# EAGLE design LED Scematic Version3 (EAGLE 9.2.0)
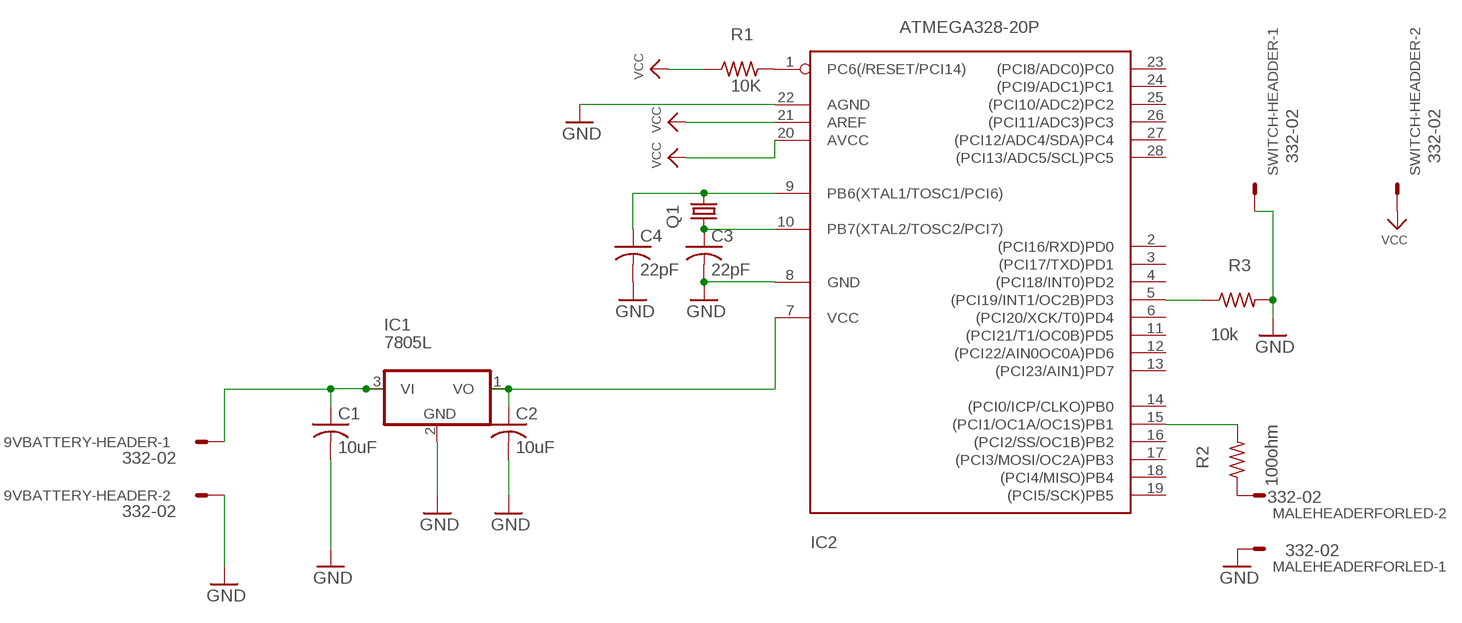
[diagram p0: schematic, sheet 1]

## Parts
9VBATTERY-HEADER  332-02  [332-02]
C1  10uF  C-US025-040X050  [C025-040X050]
C2  10uF  C-US025-040X050  [C025-040X050]
C3  22pF  C-US025-040X050  [C025-040X050]
C4  22pF  C-US025-040X050  [C025-040X050]
IC1  7805L  [TO92]
IC2  ATMEGA328-20P  [DIL28-3]
MALEHEADERFORLED  332-02  [332-02]
Q1  CRYSTALHC49S  [HC49/S]
R1  10K  R-US_0207/12  [0207/12]
R2  100ohm  R-US_0207/12  [0207/12]
R3  10k  R-US_0207/12  [0207/12]
SWITCH-HEADDER  332-02  [332-02]

## Nets
GND: 9VBATTERY-HEADER.2 C1.2 C2.2 C3.2 C4.2 IC1.2(GND) IC2.8(GND) IC2.22(AGND) MALEHEADERFORLED.1 R3.2 SWITCH-HEADDER.1
N$1: IC2.1(PC6(/RESET/PCI14)) R1.2
N$2: C4.1 IC2.9(PB6(XTAL1/TOSC1/PCI6)) Q1.2
N$3: C3.1 IC2.10(PB7(XTAL2/TOSC2/PCI7)) Q1.1
N$4: 9VBATTERY-HEADER.1 C1.1 IC1.3(VI)
N$5: C2.1 IC1.1(VO) IC2.7(VCC)
N$6: IC2.5((PCI19/INT1/OC2B)PD3) R3.1
N$7: IC2.15((PCI1/OC1A/OC1S)PB1) R2.2
N$8: MALEHEADERFORLED.2 R2.1
VCC: IC2.20(AVCC) IC2.21(AREF) R1.1 SWITCH-HEADDER.2
Unconnected: IC2.2((PCI16/RXD)PD0) IC2.3((PCI17/TXD)PD1) IC2.4((PCI18/INT0)PD2) IC2.6((PCI20/XCK/T0)PD4) IC2.11((PCI21/T1/OC0B)PD5) IC2.12((PCI22/AIN0OC0A)PD6) IC2.13((PCI23/AIN1)PD7) IC2.14((PCI0/ICP/CLKO)PB0) IC2.16((PCI2/SS/OC1B)PB2) IC2.17((PCI3/MOSI/OC2A)PB3) IC2.18((PCI4/MISO)PB4) IC2.19((PCI5/SCK)PB5) IC2.23((PCI8/ADC0)PC0) IC2.24((PCI9/ADC1)PC1) IC2.25((PCI10/ADC2)PC2) IC2.26((PCI11/ADC3)PC3) IC2.27((PCI12/ADC4/SDA)PC4) IC2.28((PCI13/ADC5/SCL)PC5)

## Library data of the parts
9VBATTERY-HEADER MALEHEADERFORLED SWITCH-HEADDER = con-garry:332-02: 2 Pin - 2mm Dual Row Source: www.mpe-connector.de / garry_shortform_2012.pdf
C1-C4 = adafruit:C-US: CAPACITOR, American symbol
IC1 = adafruit:78*: Positive VOLTAGE REGULATOR Added bigger pads to the TO-92 package
IC2 = atmega328:ATMEGA328*P: MICROCONTROLLER 32 kBytes FLASH 2 kBytes SRAM 1 kBytes EEPROM USART 8-channel 10 bit ADC
Q1 = adafruit:CRYSTAL: CRYSTAL; OC_FARNELL: 1667008; OC_NEWARK: unknown
R1 R2 = adafruit:R-US_: RESISTOR, American symbol
R3 = adafruit:R-US_: RESISTOR, American symbol; SPICEPREFIX: R

## Net classes
0 default: width 0.508 mm, clearance 0.508 mm

## Board
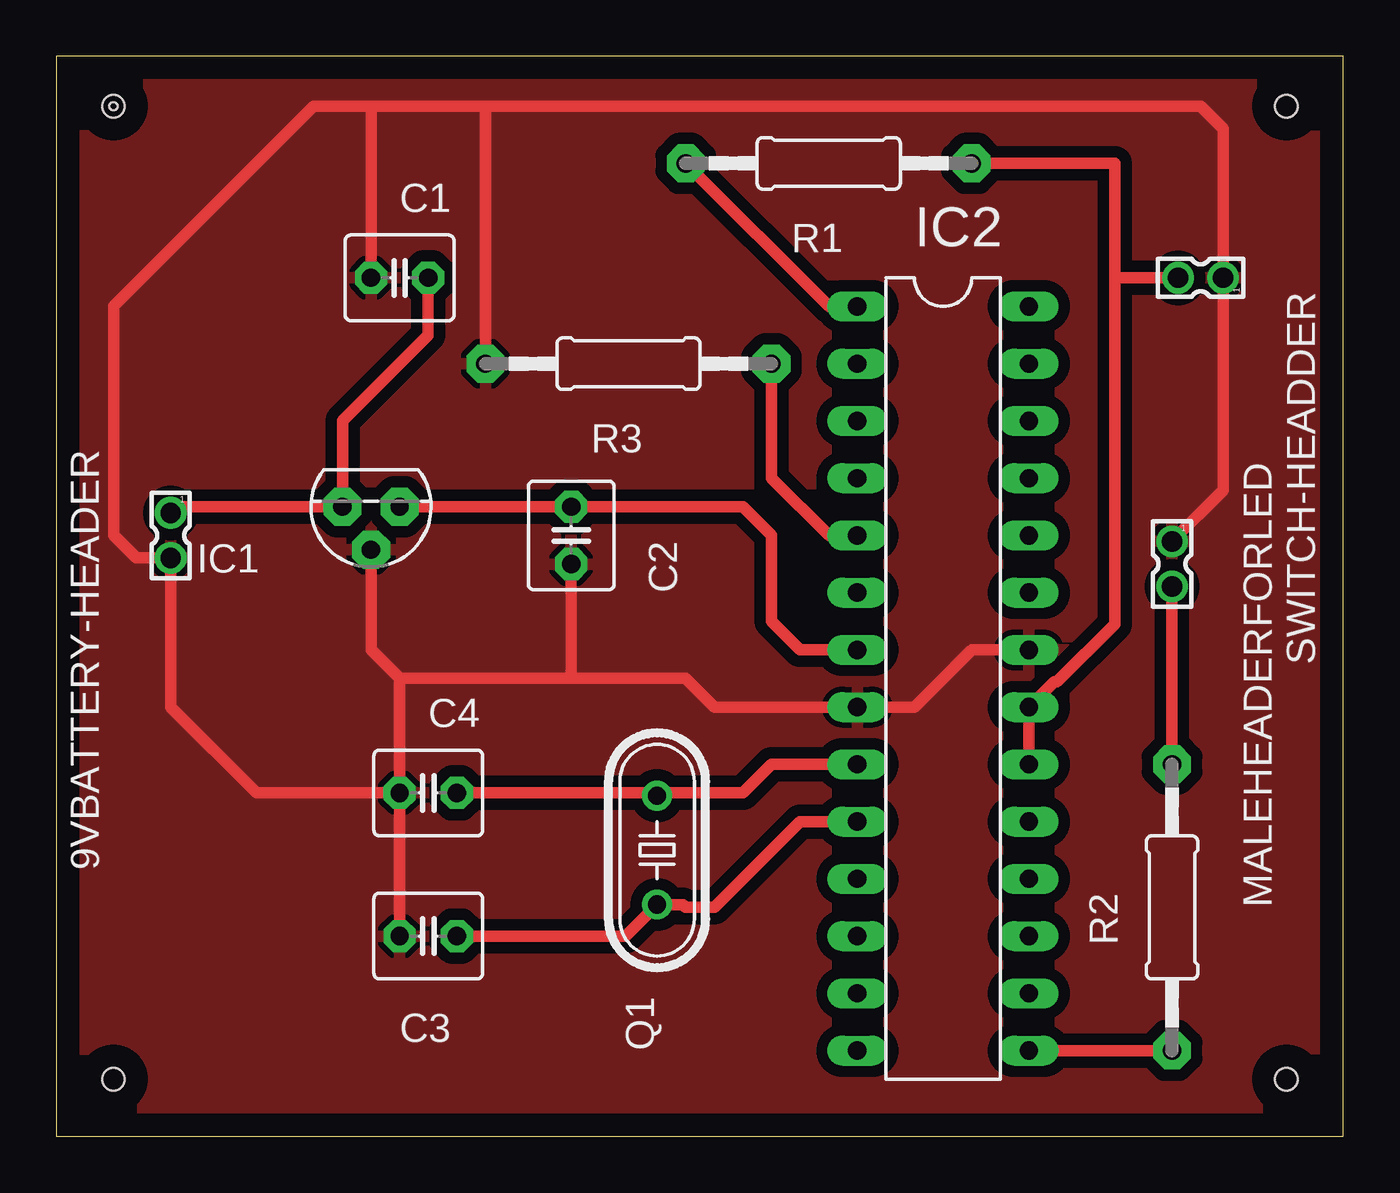
[diagram p1: board, top side]

Size 57.13 x 47.93 mm. Coordinates in mm from the lower left corner, seen from the top.
Outline: 0,0 57.13,0 57.13,47.93 0,47.93 0,0
Copper layers (1*16): Top 0.035mm / dielectric 1.5mm / Bottom 0.035mm
Design rules "default": minimum track width 6mil, minimum drill 0.35mm, track to track 6mil, track to pad 6mil, pad to pad 6mil, via to via 6mil, smd to smd 6mil, copper to edge 40mil, drill to drill 6mil, minimum pad ring 10mil, minimum via ring 8mil, stop-mask expansion 4mil, vias tented up to drill 0mil, thermal gap 10mil
Holes 0.35 mm at 2.54,45.72 2.54,45.72 2.54,45.72 2.54,45.72 2.54,45.72 2.54,45.72 2.54,45.72 2.54,45.72 2.54,45.72 2.54,45.72 2.54,45.72
Holes 1 mm at 54.61,45.72 2.54,2.54 54.61,2.54 2.54,45.72

### Footprints (pad centres in the part's own frame; a part is rotated, then mirrored left to right if it is on the bottom)
332-02 = drill 0.9 pad 1.27: 1 0,-1; 2 0,1
C025-040X050 = drill 0.813 pad 1.422 octagon: 1 -1.27,0; 2 1.27,0
TO92 = drill 0.813 pad 1.676 octagon: 1 -1.27,0; 2 0,1.905; 3 1.27,0
DIL28-3 = drill 0.813 long: 1 -16.51,-3.81; 2 -13.97,-3.81; 3 -11.43,-3.81; 4 -8.89,-3.81; 5 -6.35,-3.81; 6 -3.81,-3.81; 7 -1.27,-3.81; 8 1.27,-3.81; 9 3.81,-3.81; 10 6.35,-3.81; 11 8.89,-3.81; 12 11.43,-3.81; 13 13.97,-3.81; 14 16.51,-3.81; 15 16.51,3.81; 16 13.97,3.81; 17 11.43,3.81; 18 8.89,3.81; 19 6.35,3.81; 20 3.81,3.81; 21 1.27,3.81; 22 -1.27,3.81; 23 -3.81,3.81; 24 -6.35,3.81; 25 -8.89,3.81; 26 -11.43,3.81; 27 -13.97,3.81; 28 -16.51,3.81
HC49/S = drill 0.813: 1 -2.413,0; 2 2.413,0
0207/12 = drill 0.813 pad 1.676 octagon: 1 -6.35,0; 2 6.35,0

### Placement (x,y rotation side)
9VBATTERY-HEADER  5.08,26.67 180 top
C1  15.24,38.1 180 top
C2  22.86,26.67 270 top
C3  16.51,8.89 180 top
C4  16.51,15.24 180 top
IC1  13.97,27.94 180 top
IC2  39.37,20.32 270 top
MALEHEADERFORLED  49.53,25.4 180 top
Q1  26.67,12.7 90 top
R1  34.29,43.18 180 top
R2  49.53,10.16 270 top
R3  25.4,34.29 180 top
SWITCH-HEADDER  50.8,38.1 90 top

### Tracks (layer width: path | path; a pad name or v marks a point on that pad's centre or on a via)
GND
  Top 0.508: C4.2 C3.2 | SWITCH-HEADDER.1 51.8,30.21 | MALEHEADERFORLED.1 51.8,28.67 SWITCH-HEADDER.1 | C2.2 22.86,20.32 | 22.86,20.32 27.94,20.32 29.21,19.05 IC2.8 38.1,19.05 40.64,21.59 IC2.22 | C4.2 8.89,15.24 5.08,19.05 9VBATTERY-HEADER.2 3.54,25.67 2.54,26.67 2.54,36.83 11.43,45.72 13.97,45.72 | 22.86,20.32 15.24,20.32 | 15.24,20.32 13.97,21.59 IC1.2 | 15.24,20.32 C4.2 | 52.07,38.37 SWITCH-HEADDER.1 | SWITCH-HEADDER.1 51.8,44.72 50.8,45.72 19.05,45.72 | 19.05,45.72 13.97,45.72 | 19.05,45.72 R3.2 | C1.2 13.97,45.72
  pour Top: -1.27,48.26 -1.27,-1.27 57.69,-1.27 57.69,48.26
N$1
  Top 0.508: IC2.1 34.29,36.83 R1.2
N$2
  Top 0.508: C4.1 26.54,15.24 26.61,15.18 | Q1.2 26.61,15.18 | IC2.9 31.75,16.51 30.48,15.24 26.67,15.24 26.61,15.18
N$3
  Top 0.508: C3.1 25.27,8.89 Q1.1 27.81,10.29 27.94,10.16 29.21,10.16 33.02,13.97 IC2.10
N$4
  Top 0.508: 9VBATTERY-HEADER.1 5.35,27.94 IC1.3 12.7,31.75 16.51,35.56 C1.1
N$5
  Top 0.508: IC1.1 C2.1 30.48,27.94 31.75,26.67 31.75,22.86 33.02,21.59 IC2.7
N$6
  Top 0.508: IC2.5 34.29,26.67 31.75,29.21 R3.1
N$7
  Top 0.508: R2.2 IC2.15
N$8
  Top 0.508: MALEHEADERFORLED.2 R2.1
VCC
  Top 0.508: IC2.20 IC2.21 44.3,20.17 44.43,20.17 46.99,22.73 46.99,38.1 | R1.1 46.99,43.18 46.99,38.1 | SWITCH-HEADDER.2 46.99,38.1